# Altium project SAMA5D27-SOM1-EK1_ REVD1.PrjPcb (part 4 of 6)

## Sheet 07) SD & QSPI.SchDoc
size B; CompanyName: Microchip Technology Inc.; Organization: Microchip Technology; Address1: 2355 West Chandler Blvd.; Address2: Chandler, AZ  85224; Address4: USA; DocumentNumber: 7; SheetNumber: 7; SheetTotal: 9; SheetTitle: **; Time: Time
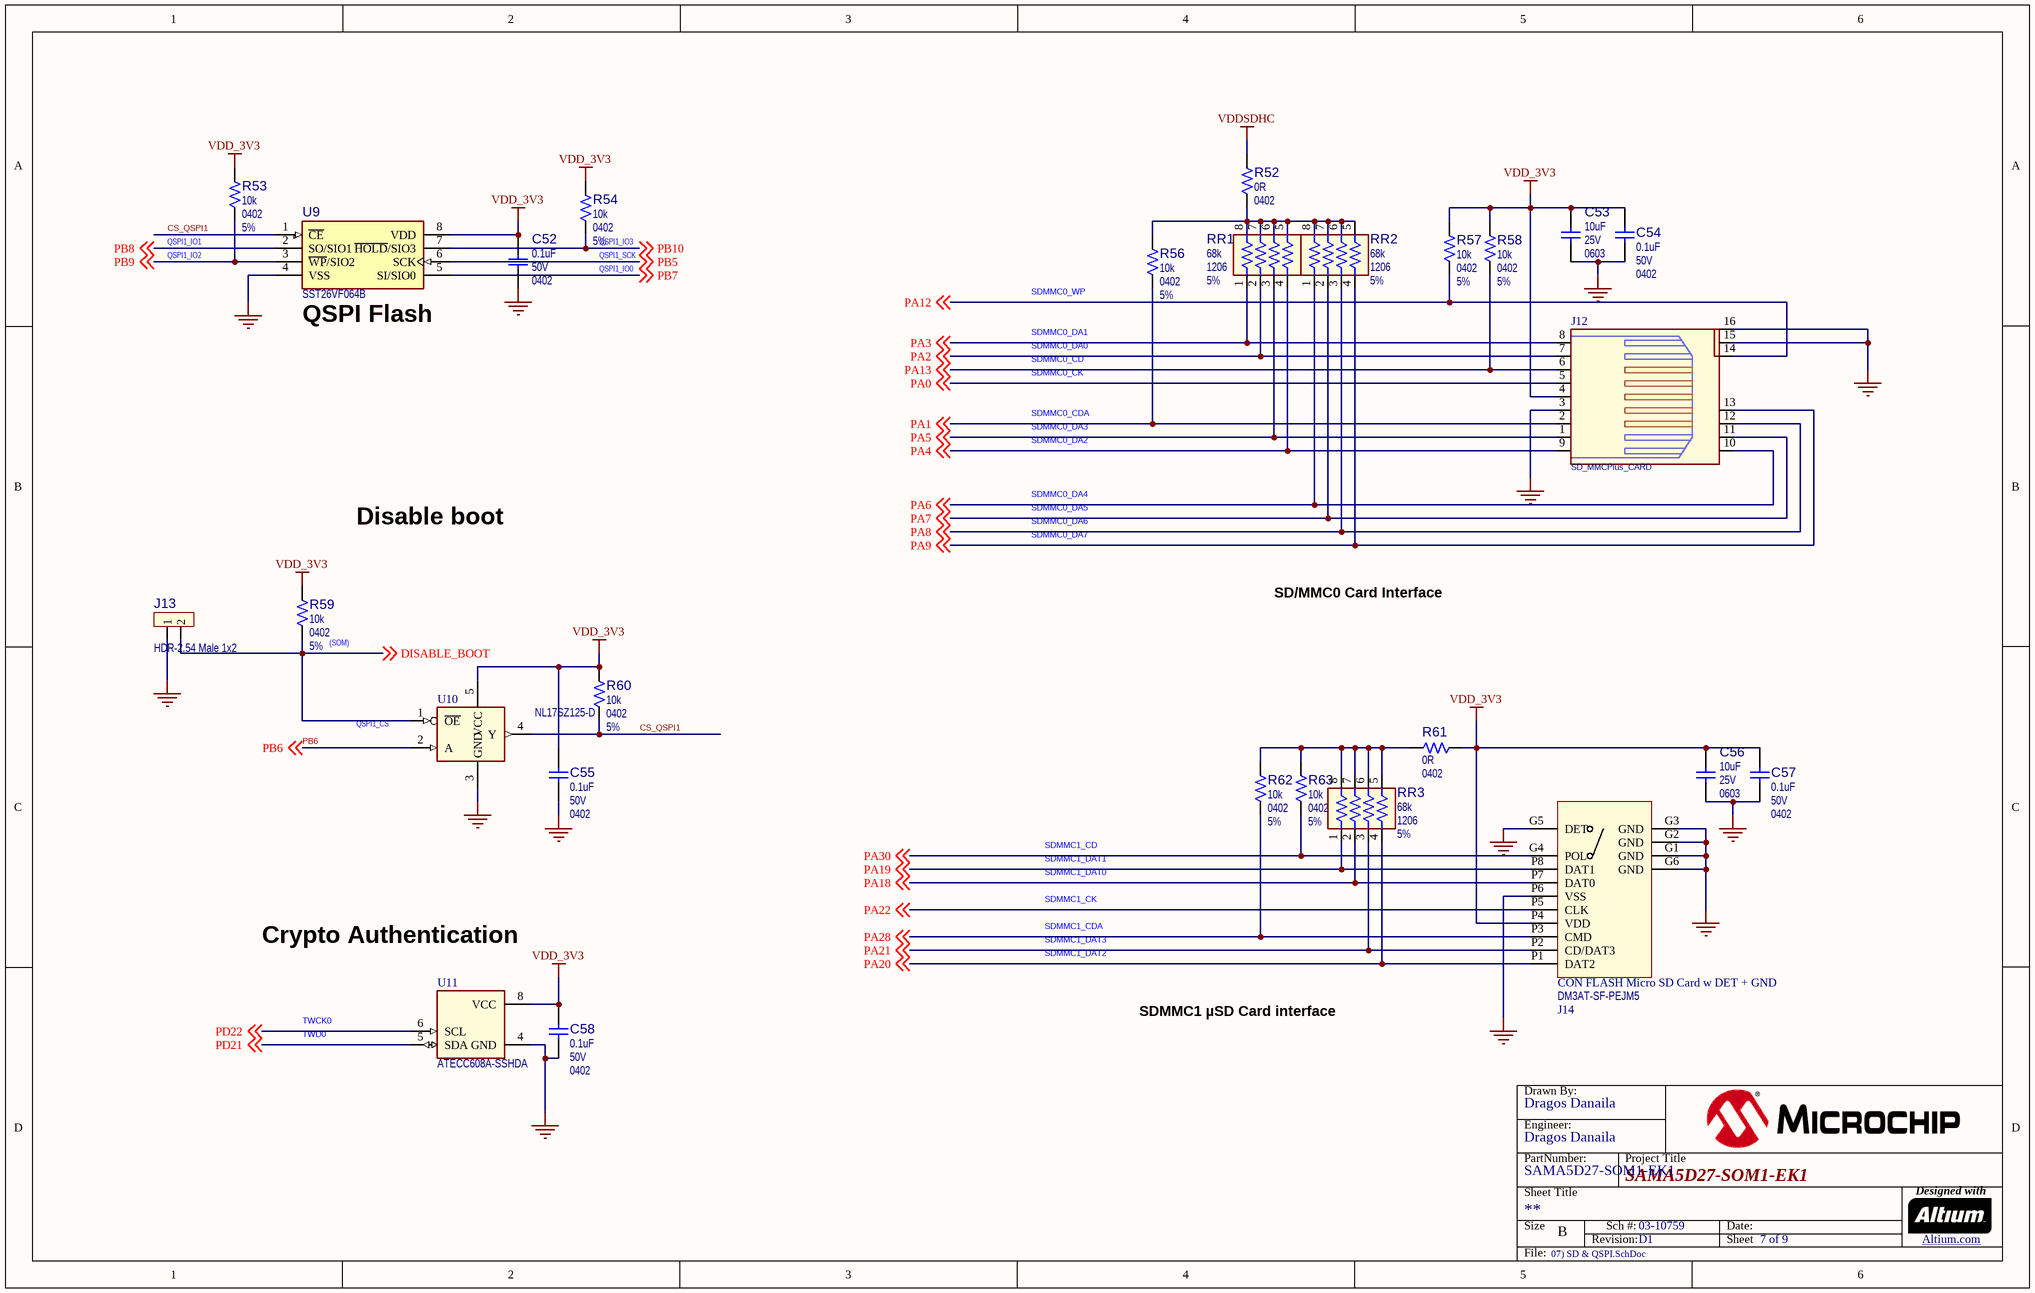
[diagram p6: 07) SD & QSPI.SchDoc]

### Parts
(Parts that share a designator on the sheet are numbered #1, #2 ... from top to bottom, then left to right.)
?#7  (no value)  (graphical)
C52  value 0.1uF  Voltage: 50V  Package: 0402  [CAP_C_0402]  (hidden comment: Capacitor NP)
C53  value 10uF  Voltage: 25V  Package: 0603  [CAP_C_0603]  (hidden comment: Capacitor NP)
C54  value 0.1uF  Voltage: 50V  Package: 0402  [CAP_C_0402]  (hidden comment: Capacitor NP)
C55  value 0.1uF  Voltage: 50V  Package: 0402  [CAP_C_0402]  (hidden comment: Capacitor NP)
C56  value 10uF  Voltage: 25V  Package: 0603  [CAP_C_0603]  (hidden comment: Capacitor NP)
C57  value 0.1uF  Voltage: 50V  Package: 0402  [CAP_C_0402]  (hidden comment: Capacitor NP)
C58  value 0.1uF  Voltage: 50V  Package: 0402  [CAP_C_0402]  (hidden comment: Capacitor NP)
J12  SD_MMCPlus_CARD  [7SDMM-X0-2211]
J13  value HDR-2.54 Male 1x2  [HDR_M_2.54_1x2]  (hidden comment: Header 1x2)
J14  CON FLASH Micro SD Card w DET + GND  value DM3AT-SF-PEJM5  [CON FLASH microSD 8+2P Push-Push SMD]
R52  value 0R  Package: 0402  [RES_C_0402]  (hidden comment: Resistor)
R53  value 10k  Package: 0402  Tolerance: 5%  [RES_C_0402]  (hidden comment: Resistor)
R54  value 10k  Package: 0402  Tolerance: 5%  [RES_C_0402]  (hidden comment: Resistor)
R56  value 10k  Package: 0402  Tolerance: 5%  [RES_C_0402]  (hidden comment: Resistor)
R57  value 10k  Package: 0402  Tolerance: 5%  [RES_C_0402]  (hidden comment: Resistor)
R58  value 10k  Package: 0402  Tolerance: 5%  [RES_C_0402]  (hidden comment: Resistor)
R59  value 10k  Package: 0402  Tolerance: 5%  [RES_C_0402]  (hidden comment: Resistor)
R60  value 10k  Package: 0402  Tolerance: 5%  [RES_C_0402]  (hidden comment: Resistor)
R61  value 0R  Package: 0402  [RES_C_0402]  (hidden comment: Resistor)
R62  value 10k  Package: 0402  Tolerance: 5%  [RES_C_0402]  (hidden comment: Resistor)
R63  value 10k  Package: 0402  Tolerance: 5%  [RES_C_0402]  (hidden comment: Resistor)
RR1  value 68k  Package: 1206  Tolerance: 5%  [RES_C_CAV_0603x4]  (hidden comment: Resistor Network 4-Ch)
RR2  value 68k  Package: 1206  Tolerance: 5%  [RES_C_CAV_0603x4]  (hidden comment: Resistor Network 4-Ch)
RR3  value 68k  Package: 1206  Tolerance: 5%  [RES_C_CAV_0603x4]  (hidden comment: Resistor Network 4-Ch)
U9  value SST26VF064B  [SOIJ-8]  (hidden comment: SST26VFXXX SOIC-8_WSON-8_SOIJ-8)
U10  value NL17SZ125-D  [SOT-353]  (hidden comment: NL17SZ125-D SOT-353)
U11  value ATECC608A-SSHDA  [SOIC-8]  (hidden comment: ATECC608A-SSHDA-B SOIC-8)

### Nets
GND_POWER: C52.2 C53.2 C54.2 C55.2 C56.2 C57.2 C58.2 J12.3 J12.15(GND) J12.16(NC) J13.1 J14.G1(GND) J14.G2(GND) J14.G3(GND) J14.G5(DET) J14.G6(GND) J14.P6(VSS) U9.4(VSS) U10.3(GND) U11.4(GND)  [project net GND]
VDD_3V3: C52.1 C53.1 C54.1 C55.1 C56.1 C57.1 C58.1 J12.4 J14.P4(VDD) R53.1 R54.1 R57.1 R58.1 R59.1 R60.1 R61.2 U9.8(VDD) U10.5(VCC) U11.8(VCC)
VDDSDHC: R52.1
CS_QSPI1: R60.2 U9.1(~{CE}) U10.4(Y)
DISABLE_BOOT: J13.2 R59.2 U10.1(~{OE}) ; off-sheet DISABLE_BOOT
PA0: J12.5 ; off-sheet PA0
PA1: J12.2 R56.2 ; off-sheet PA1
PA2: J12.7 RR1.2 ; off-sheet PA2
PA3: J12.8 RR1.1 ; off-sheet PA3
PA4: J12.9 RR1.4 ; off-sheet PA4
PA5: J12.1 RR1.3 ; off-sheet PA5
PA6: J12.10 RR2.1 ; off-sheet PA6
PA7: J12.11 RR2.2 ; off-sheet PA7
PA8: J12.12 RR2.3 ; off-sheet PA8
PA9: J12.13 RR2.4 ; off-sheet PA9
PA12: J12.14(WP) R57.2 ; off-sheet PA12
PA13: J12.6 R58.2 ; off-sheet PA13
PA18: J14.P7(DAT0) RR3.2 ; off-sheet PA18
PA19: J14.P8(DAT1) RR3.1 ; off-sheet PA19
PA20: J14.P1(DAT2) RR3.4 ; off-sheet PA20
PA21: J14.P2(CD/DAT3) RR3.3 ; off-sheet PA21
PA22: J14.P5(CLK) ; off-sheet PA22
PA28: J14.P3(CMD) R62.2 ; off-sheet PA28
PA30: J14.G4(POL) R63.2 ; off-sheet PA30
PB5: U9.6(SCK) ; off-sheet PB5
PB6: U10.2(A) ; off-sheet PB6
PB7: U9.5(SI/SIO0) ; off-sheet PB7
PB8: U9.2(SO/SIO1) ; off-sheet PB8
PB9: R53.2 U9.3(~{WP}/SIO2) ; off-sheet PB9
PB10: R54.2 U9.7(~{HOLD}/SIO3) ; off-sheet PB10
PD21: U11.5(SDA) ; off-sheet PD21
PD22: U11.6(SCL) ; off-sheet PD22
NetR52_2: R52.2 R56.1 RR1.5 RR1.6 RR1.7 RR1.8 RR2.5 RR2.6 RR2.7 RR2.8
NetR61_1: R61.1 R62.1 R63.1 RR3.5 RR3.6 RR3.7 RR3.8

### Notes on the sheet
- (near R53) QSPI1_IO1
- (near R53) QSPI1_IO2
- (near R54) QSPI1_SCK
- (near R54) QSPI1_IO0
- (near R54) QSPI1_IO3
- SDMMC0_WP
- (near U9) QSPI Flash
- SDMMC0_CD
- SDMMC0_DA1
- SDMMC0_DA0
- SDMMC0_CK
- SDMMC0_CDA
- SDMMC0_DA3
- SDMMC0_DA2
- SDMMC0_DA4
- Disable boot
- SDMMC0_DA5
- SDMMC0_DA6
- SDMMC0_DA7
- SD/MMC0 Card Interface
- (near R59) (SOM)
- (near U10) QSPI1_CS
- SDMMC1_CD
- SDMMC1_DAT0
- SDMMC1_DAT1
- SDMMC1_CK
- Crypto Authentication
- SDMMC1_CDA
- SDMMC1_DAT3
- SDMMC1_DAT2
- TWD0
- TWCK0
- SDMMC1 µSD Card interface
- Drawn By:
- Engineer:
- PartNumber:
- Project Title
- Sheet Title
- Size
- B
- Revision:
- Sch #:
- Date:
- Sheet
- Designed with
- Altium.com <http://go.altium.com/MicrochipLandingPage_Evaluation.html>
- File:

### Library data of the parts
?#7 = Title Block B
C52 C54 C55 C57 C58 = CAP1463: Capacitor; Manufacturer 1: TDK Corporation; Manufacturer Part Number 1: C1005X7R1H104K050BB; Description_: CAP CER 0.1uF 50V 10% X7R SMD 0402; Dev Tools Status: Production; Tolerance: 10%; Temperature Coeffcient: X7R; Type: Ceramic; Owner: Jamus Griego; Populated: YES; MCHP-ID: CAP1463; Revision: 1; Symbol: Capacitor NP; Status: MCL Design; ComponentLink1URL: https://chn-vm-apps.microchip.com/mchprepo/parts/Datasheets/TDKMLCCCapRange.pdf; ComponentLink1Description: SVN Datasheet; ComponentLink2URL: C:\ALTIUM_WORK\00001_MCHP-CDB\Datasheets\TDKMLCCCapRange.pdf; ComponentLink2Description: Local Datasheet; ComponentLink3URL: C:\ALTIUM_WORK\00001_MCHP-CDB\Library\LibraryRefs\Capacitor NP.SchLib; ComponentLink3Description: Open Symbol; ComponentLink4URL: C:\ALTIUM_WORK\00001_MCHP-CDB\Library\Footprints\CAP_C_0402.PcbLib; ComponentLink4Description: Open Footprint; ComponentLink5Description: Open Footprint 2; ComponentLink6Description: Open Footprint 3; ComponentLink7Description: Open Footprint 4; Operating Temperature: -55C to +125C; Category: Capacitor; Supplier 1: Digi-Key; Supplier Part Number 1: 445-5932-1-ND; Quantity Override: 1
C53 C56 = CAP1650: Capacitor; Manufacturer 1: TDK Corporation; Manufacturer Part Number 1: C1608X5R1E106M080AC; Description_: CAP CER 10uF 25V 20% X5R SMD 0603; Dev Tools Status: Design; Tolerance: 20%; Temperature Coeffcient: X5R; Type: Ceramic; Owner: Razvan Cristescu; Populated: YES; MCHP-ID: CAP1650; Revision: A; Symbol: Capacitor NP; Status: MCL Design; ComponentLink1URL: https://chn-vm-apps.microchip.com/mchprepo/parts/Datasheets/1913358.pdf; ComponentLink1Description: SVN Datasheet; ComponentLink2URL: C:\ALTIUM_WORK\00001_MCHP-CDB\Datasheets\1913358.pdf; ComponentLink2Description: Local Datasheet; ComponentLink3URL: C:\ALTIUM_WORK\00001_MCHP-CDB\Library\LibraryRefs\Capacitor NP.SchLib; ComponentLink3Description: Open Symbol; ComponentLink4URL: C:\ALTIUM_WORK\00001_MCHP-CDB\Library\Footprints\CAP_C_0603.PcbLib; ComponentLink4Description: Open Footprint; ComponentLink5Description: Open Footprint 2; ComponentLink6Description: Open Footprint 3; ComponentLink7Description: Open Footprint 4; Operating Temperature: -55C to +85C; Category: Capacitor; Supplier 1: Farnell; Supplier Part Number 1: 2521968; Quantity Override: 1
J12 = CON1681: 5 IN 1 CARD CONNECTOR(SD & MMC; Manufacturer 1: Kingconn Technology Co., Ltd.; Description_: CON FLASH SD/MMC 14P Push-Pull SMD R/A; Dev Tools Status: Design; Owner: Dragos Danaila; Populated: YES; MCHP-ID: CON1681; Revision: A; Symbol: SD_MMCPlus_CARD; Status: MCL Design; ComponentLink1URL: https://chn-vm-apps.microchip.com/mchprepo/parts/Datasheets/7SDMM-X0-2211-C.pdf; ComponentLink1Description: SVN Datasheet; ComponentLink2URL: C:\ALTIUM_WORK\00001_MCHP-CDB\Datasheets\7SDMM-X0-2211-C.pdf; ComponentLink2Description: Local Datasheet; ComponentLink3URL: C:\ALTIUM_WORK\00001_MCHP-CDB\Library\LibraryRefs\SD_MMCPlus_CARD.SchLib; ComponentLink3Description: Open Symbol; ComponentLink4URL: C:\ALTIUM_WORK\00001_MCHP-CDB\Library\Footprints\7SDMM-X0-2211.PcbLib; ComponentLink4Description: Open Footprint; ComponentLink5Description: Open Footprint 2; ComponentLink6Description: Open Footprint 3; ComponentLink7Description: Open Footprint 4; Type: Flash Card; Category: Connector; Manufacturer Part Number 1: 7SDMM-X0-2211; Supplier 1: Kingconn Technology Co., Ltd.; Supplier Part Number 1: 7SDMM-X0-2211; Quantity Override: 1
J13 = CON1108: Manufacturer 1: FCI; Manufacturer Part Number 1: 77311-118-02LF; Description_: CON HDR-2.54 Male 1x2 Gold 5.84MH TH VERT; Dev Tools Status: Production; Owner: Bogdan P (M91398); Populated: Yes; MCHP-ID: CON1108; Revision: 1; Symbol: Header 1x2; Status: MCL Design; ComponentLink1URL: https://chn-vm-apps.microchip.com/mchprepo/parts/Datasheets/77311.pdf; ComponentLink1Description: SVN Datasheet; ComponentLink2URL: C:\ALTIUM_WORK\00001_MCHP-CDB\Datasheets\77311.pdf; ComponentLink2Description: Local Datasheet; ComponentLink3URL: C:\ALTIUM_WORK\00001_MCHP-CDB\Library\LibraryRefs\Header 1x2.SchLib; ComponentLink3Description: Open Symbol; ComponentLink4URL: C:\ALTIUM_WORK\00001_MCHP-CDB\Library\Footprints\HDR_M_2.54_1x2.PcbLib; ComponentLink4Description: Open Footprint; ComponentLink5Description: Open Footprint 2; ComponentLink6Description: Open Footprint 3; ComponentLink7Description: Open Footprint 4; Type: Header 2.54mm; Category: Connector; Manufacturer 2: FCI; Manufacturer Part Number 2: 68001-202HLF; Manufacturer 3: FCI; Manufacturer Part Number 3: 68000-202HLF; Manufacturer 4: Samtec; Manufacturer Part Number 4: TSW-102-07-G-S; Manufacturer 5: Sullins; Manufacturer Part Number 5: PBC02SAAN; Manufacturer 6: SPC Technology; Manufacturer Part Number 6: SPC20481; Manufacturer 7: Samtec; Manufacturer Part Number 7: TSW-102-07-F-S; Manufacturer 8: Nextron; Manufacturer Part Number 8: R-211-0211-0021-000; Manufacturer 9: Samtec; Manufacturer Part Number 9: TSW-102-07-S-S; Supplier 1: Digi-Key; Supplier Part Number 1: 609-4434-ND; Supplier 2: Digi-Key; Supplier Part Number 2: 609-3469-ND; Supplier 3: Digi-Key; Supplier Part Number 3: 609-3502-ND; Supplier 4: Digi-Key; Supplier Part Number 4: SAM1029-02-ND; Supplier 5: Digi-Key; Supplier Part Number 5: S1011E-02-ND; Supplier 6: Newark; Supplier Part Number 6: 93K5734; Supplier 7: Newark; Supplier Part Number 7: 79P3146; Supplier 8: Raynen; Supplier Part Number 8: R-211-0211-0021-000; Supplier 9: Samtec; Supplier Part Number 9: TSW-102-07-S-S; Quantity Override: 1
J14 = CON1640: Manufacturer 1: Hirose Electric Co Ltd; Dev Tools Status: Design; Owner: Dragos Danaila; Voltage: 125VAC; Current: 0.5A; Populated: YES; MCHP-ID: CON1640; Revision: A; Symbol: CON FLASH Micro SD Card w DET + GND; Description_: CON FLASH microSD 8+2P Push-Push SMD; Status: MCL Design; ComponentLink1URL: https://chn-vm-apps.microchip.com/mchprepo/parts/Datasheets/DM3_catalog; ComponentLink1Description: SVN Datasheet; ComponentLink2URL: C:\ALTIUM_WORK\00001_MCHP-CDB\Datasheets\DM3_catalog; ComponentLink2Description: Local Datasheet; ComponentLink3URL: C:\ALTIUM_WORK\00001_MCHP-CDB\Library\LibraryRefs\CON FLASH Micro SD Card w DET + GND.SchLib; ComponentLink3Description: Open Symbol; ComponentLink4URL: C:\ALTIUM_WORK\00001_MCHP-CDB\Library\Footprints\CON FLASH microSD 8+2P Push-Push SMD.PcbLib; ComponentLink4Description: Open Footprint; ComponentLink5Description: Open Footprint 2; ComponentLink6Description: Open Footprint 3; ComponentLink7Description: Open Footprint 4; Type: Flash Card; Category: Connector; Manufacturer Part Number 1: DM3AT-SF-PEJM5; Supplier 1: Digi-Key; Supplier Part Number 1: HR1964CT-ND; Quantity Override: 1
R52 R61 = RSMT0730: Manufacturer 1: Panasonic; Manufacturer Part Number 1: ERJ-2GE0R00X; Description_: RES TKF 0R SMD 0402; Dev Tools Status: Production; Power: 1/10W; Populated: Yes; MCHP-ID: RSMT0730; Revision: 2; Symbol: Resistor; Status: MCL Design; ComponentLink1URL: https://chn-vm-apps.microchip.com/mchprepo/parts/Datasheets/AOA0000CE1.pdf; ComponentLink1Description: SVN Datasheet; ComponentLink2URL: C:\ALTIUM_WORK\00001_MCHP-CDB\Datasheets\AOA0000CE1.pdf; ComponentLink2Description: Local Datasheet; ComponentLink3URL: C:\ALTIUM_WORK\00001_MCHP-CDB\Library\LibraryRefs\Resistor.SchLib; ComponentLink3Description: Open Symbol; ComponentLink4URL: C:\ALTIUM_WORK\00001_MCHP-CDB\Library\Footprints\RES_C_0402.PcbLib; ComponentLink4Description: Open Footprint; ComponentLink5Description: Open Footprint 2; ComponentLink6Description: Open Footprint 3; ComponentLink7Description: Open Footprint 4; Operating Temperature: -55C to +155C; Category: Resistor; Type: RES SMD; Composition: TKF; Manufacturer 2: Vishay; Manufacturer Part Number 2: CRCW04020000Z0ED; Supplier 1: Digi-Key; Supplier Part Number 1: P0.0JCT-ND; Supplier 2: Digi-Key; Supplier Part Number 2: 541-0.0JTR-ND; Quantity Override: 1
R53 R54 R56-R60 R62 R63 = RSMT0439: Manufacturer 1: Vishay; Manufacturer Part Number 1: CRCW040210K0JNED; Description_: RES TKF 10k 5% 1/16W SMD 0402; Dev Tools Status: Production; Voltage: 50V; Temperature Coeffcient: 100ppm/C; Power: 1/16W; Populated: Yes; MCHP-ID: RSMT0439; Revision: 1; Symbol: Resistor; Status: MCL Design; ComponentLink1URL: https://chn-vm-apps.microchip.com/mchprepo/parts/Datasheets/PYu-RC0402_51_RoHS_L_6.pdf; ComponentLink1Description: SVN Datasheet; ComponentLink2URL: C:\ALTIUM_WORK\00001_MCHP-CDB\Datasheets\PYu-RC0402_51_RoHS_L_6.pdf; ComponentLink2Description: Local Datasheet; ComponentLink3URL: C:\ALTIUM_WORK\00001_MCHP-CDB\Library\LibraryRefs\Resistor.SchLib; ComponentLink3Description: Open Symbol; ComponentLink4URL: C:\ALTIUM_WORK\00001_MCHP-CDB\Library\Footprints\RES_C_0402.PcbLib; ComponentLink4Description: Open Footprint; ComponentLink5Description: Open Footprint 2; ComponentLink6Description: Open Footprint 3; ComponentLink7Description: Open Footprint 4; Operating Temperature: -55C to +155C; Category: Resistor; Type: RES SMD; Composition: TKF; Manufacturer 2: Yageo; Manufacturer Part Number 2: RC0402JR-0710KL; Supplier 1: Digi-Key; Supplier Part Number 1: 541-10KJCT-ND; Supplier 2: Digi-Key; Supplier Part Number 2: 311-10KJRCT-ND; Quantity Override: 1
RR1-RR3 = RNET1004: Resistor; Manufacturer 1: Yageo; Manufacturer Part Number 1: YC164-JR-0768KL; Description_: RES NET 68k 5% 62.5mW SMD 0603x4; Dev Tools Status: Design; Voltage: 50V; Temperature Coeffcient: 200ppm/C; Current: 1A; Power: 62.5mW; Owner: Alexandru Chiser - M19201; Populated: YES; MCHP-ID: RNET1004; Revision: A; Symbol: Resistor Network 4-Ch; Status: MCL Design; ComponentLink1URL: https://chn-vm-apps.microchip.com/mchprepo/parts/Datasheets/YC102-358,TC122-164_Series_DS; ComponentLink1Description: SVN Datasheet; ComponentLink2URL: C:\ALTIUM_WORK\00001_MCHP-CDB\Datasheets\YC102-358,TC122-164_Series_DS; ComponentLink2Description: Local Datasheet; ComponentLink3URL: C:\ALTIUM_WORK\00001_MCHP-CDB\Library\LibraryRefs\Resistor Network 4-Ch.SchLib; ComponentLink3Description: Open Symbol; ComponentLink4URL: C:\ALTIUM_WORK\00001_MCHP-CDB\Library\Footprints\RES_C_CAV_0603x4.PcbLib; ComponentLink4Description: Open Footprint; ComponentLink5Description: Open Footprint 2; ComponentLink6Description: Open Footprint 3; ComponentLink7Description: Open Footprint 4; Operating Temperature: -55C to +155C; Category: Resistor; Type: RES Network SMD; Supplier 1: Digi-Key; Supplier Part Number 1: YC164J-68KCT-ND; Quantity Override: 1
U9 = MIC6216: SQI Serial Flash; Manufacturer 1: Microchip Technology; Manufacturer Part Number 1: SST26VF064B-104I/SM; Description_: MCHP SERIAL FLASH SST26VF064B-104I/SM SOIJ-8; MAPS Description: 64Mb 2.3V TO 3.6V SQI Flash Memory; Dev Tools Status: Production; Owner: Sompoch Loboonlert; MPC: S01027C3XA23; PackingMedia: TUBE; TempRange: -40C to +85C; Stage: REL; LeadCount: 8; PackageWidth: .208in; ForceMinOrderQtyMult: False; MinOrderQty: 0; LeadContent: Pb-FREE; Busmodes: SPI,SDI,SQI; MemorySizeNum: 64; OpVoltMin: 2.3; OpVoltMax: 3.6; MaxClockFreq: 104 MHz; PageSize_B: 256; WPScheme: Full Array; Endurance: 100,000; Populated: DNP; MCHP-ID: MIC6216; Symbol: SST26VFXXX SOIC-8_WSON-8_SOIJ-8; Type: Serial Flash; Status: MCL Design; Revision: 1; Category: MCHP-Memory; ComponentLink1URL: http://www.microchip.com/wwwproducts/Devices.aspx?product=SST26VF064B; ComponentLink1Description: SVN Datasheet; ComponentLink2Description: Local Datasheet; ComponentLink3URL: C:\ALTIUM_WORK\00001_MCHP-CDB\Library\LibraryRefs\SST26VFXXX SOIC-8_WSON-8_SOIJ-8.SchLib; ComponentLink3Description: Open Symbol; ComponentLink4URL: C:\ALTIUM_WORK\00001_MCHP-CDB\Library\Footprints\SOIJ-8.PcbLib; ComponentLink4Description: Open Footprint; ComponentLink5Description: Open Footprint 2; ComponentLink6Description: Open Footprint 3; ComponentLink7Description: Open Footprint 4; Supplier 1: Microchip Technology; Supplier Part Number 1: SST26VF064B-104I/SM; PackageType: SOIJ; IntroductionDate: 2014-12-05; Quantity Override: 1
U10 = IC1433: Manufacturer 1: ON Semiconductor; Manufacturer Part Number 1: NL17SZ125DFT2G; MCHP-ID: IC1433; Description_: IC BUFFER NL17SZ125DFT2G TRI-ST NON-INV SOT-353; Dev Tools Status: Design; Vin: −0.5V to +7.0V; Owner: Alexandru Chiser - M19201; Populated: DNP; Revision: A; Symbol: NL17SZ125-D SOT-353; Status: MCL Design; Package: SOT-353; ComponentLink1URL: https://chn-vm-apps.microchip.com/mchprepo/parts/Datasheets/NL17SZ125-D.PDF; ComponentLink1Description: SVN Datasheet; ComponentLink2URL: C:\ALTIUM_WORK\00001_MCHP-CDB\Datasheets\NL17SZ125-D.PDF; ComponentLink2Description: Local Datasheet; ComponentLink3URL: C:\ALTIUM_WORK\00001_MCHP-CDB\Library\LibraryRefs\NL17SZ125-D SOT-353.SchLib; ComponentLink3Description: Open Symbol; ComponentLink4URL: C:\ALTIUM_WORK\00001_MCHP-CDB\Library\Footprints\SOT-353.PcbLib; ComponentLink4Description: Open Footprint; ComponentLink5Description: Open Footprint 2; ComponentLink6Description: Open Footprint 3; ComponentLink7Description: Open Footprint 4; Operating Temperature: -55C to +125C; Type: Buffer; Category: IC; Supplier 1: Digi-Key; Supplier Part Number 1: NL17SZ125DFT2GOSCT-ND; Quantity Override: 1
U11 = MIC7054: Manufacturer 1: Microchip Technology; Description_: MCHP MEMORY SERIAL EEPROM CRYPTO I2C ATECC608A-SSHDA-B SOIC-8; Dev Tools Status: Production; Owner: Mark Loper; Populated: YES; MCHP-ID: MIC7054; Symbol: ATECC608A-SSHDA-B SOIC-8; Status: MCL Design; Revision: 1; Category: MCHP-Memory; ComponentLink1Description: SVN Datasheet; ComponentLink2Description: Local Datasheet; ComponentLink3URL: C:\ALTIUM_WORK\00001_MCHP-CDB\Library\LibraryRefs\ATECC608A-SSHDA-B SOIC-8.SchLib; ComponentLink3Description: Open Symbol; ComponentLink4URL: C:\ALTIUM_WORK\00001_MCHP-CDB\Library\Footprints\SOIC-8.PcbLib; ComponentLink4Description: Open Footprint; ComponentLink5Description: Open Footprint 2; ComponentLink6Description: Open Footprint 3; ComponentLink7Description: Open Footprint 4; Manufacturer Part Number 1: ATECC608A-SSHDA-B; Supplier 1: Microchip Technology; Supplier Part Number 1: ATECC608A-SSHDA-B; Quantity Override: 1